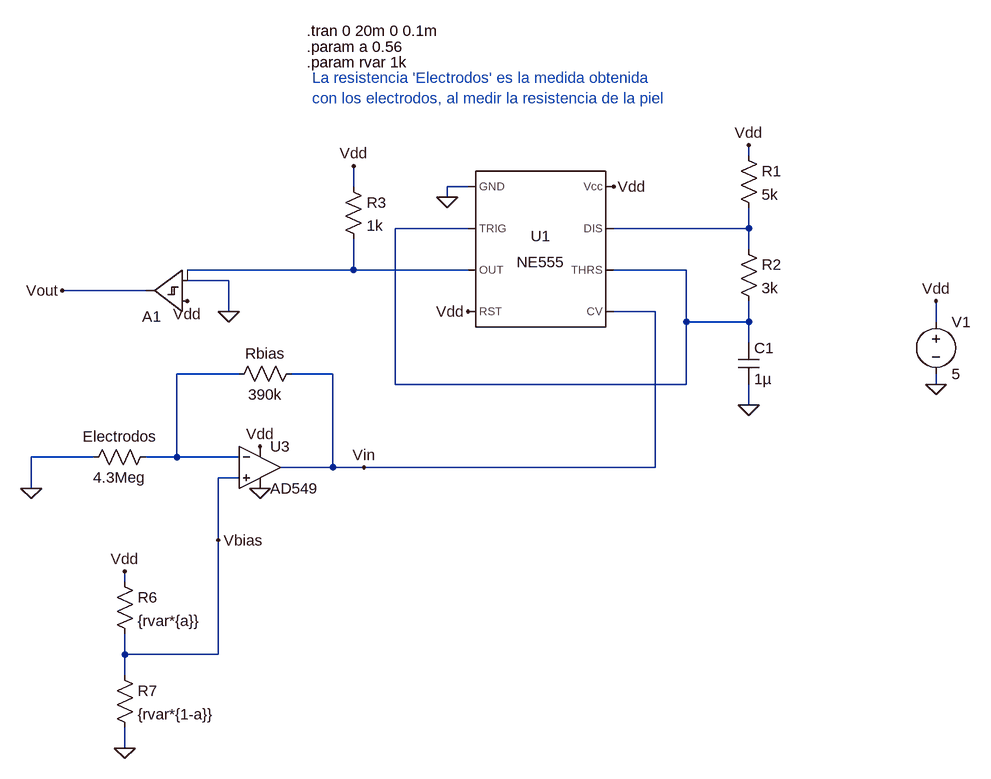
[diagram p0: schematic GSR_esquematico.asc]
GSR_esquematico.asc, the LTspice schematic file:
Version 4
SHEET 1 1032 932
WIRE 528 0 528 -16
WIRE -80 48 -80 16
WIRE 96 48 64 48
WIRE 64 64 64 48
WIRE 96 112 -16 112
WIRE 528 112 528 80
WIRE 528 112 320 112
WIRE 528 144 528 112
WIRE -80 176 -80 128
WIRE -80 176 -336 176
WIRE 96 176 -80 176
WIRE 432 176 320 176
WIRE -272 192 -336 192
WIRE -400 208 -528 208
WIRE -272 240 -272 192
WIRE 384 240 320 240
WIRE 432 256 432 176
WIRE 528 256 528 224
WIRE 528 256 432 256
WIRE 816 256 816 224
WIRE 528 288 528 256
WIRE -256 336 -352 336
WIRE -112 336 -176 336
WIRE -16 352 -16 112
WIRE 432 352 432 256
WIRE 432 352 -16 352
WIRE 816 352 816 336
WIRE 528 384 528 352
WIRE -480 464 -576 464
WIRE -352 464 -352 336
WIRE -352 464 -400 464
WIRE -256 464 -352 464
WIRE -112 480 -112 336
WIRE -112 480 -192 480
WIRE -64 480 -112 480
WIRE 384 480 384 240
WIRE 384 480 -64 480
WIRE -256 496 -288 496
WIRE -576 512 -576 464
WIRE -288 592 -288 496
WIRE -432 656 -432 640
WIRE -432 768 -432 736
WIRE -288 768 -288 592
WIRE -288 768 -432 768
WIRE -432 800 -432 768
WIRE -432 912 -432 880
FLAG 320 48 Vdd
FLAG 96 240 Vdd
FLAG 528 -16 Vdd
FLAG 528 384 0
FLAG 64 64 0
FLAG -80 16 Vdd
FLAG -528 208 Vout
FLAG 816 352 0
FLAG 816 224 Vdd
FLAG -224 512 0
FLAG -576 512 0
FLAG -64 480 Vin
FLAG -224 448 Vdd
FLAG -432 640 Vdd
FLAG -432 912 0
FLAG -272 240 0
FLAG -336 224 Vdd
FLAG -288 592 Vbias
SYMBOL Misc\\NE555 208 144 R0
SYMATTR InstName U1
SYMBOL res 512 -16 R0
SYMATTR InstName R1
SYMATTR Value 5k
SYMBOL res 512 128 R0
SYMATTR InstName R2
SYMATTR Value 3k
SYMBOL cap 512 288 R0
SYMATTR InstName C1
SYMATTR Value 1µ
SYMBOL res -96 32 R0
SYMATTR InstName R3
SYMATTR Value 1k
SYMBOL voltage 816 240 R0
SYMATTR InstName V1
SYMATTR Value 5
SYMBOL res -384 448 R90
WINDOW 0 0 56 VBottom 2
WINDOW 3 32 56 VTop 2
SYMATTR InstName Electrodos
SYMATTR Value 4.3Meg
SYMBOL res -160 320 R90
WINDOW 0 0 56 VBottom 2
WINDOW 3 32 56 VTop 2
SYMATTR InstName Rbias
SYMATTR Value 390k
SYMBOL OpAmps\\AD549 -224 416 R0
SYMATTR InstName U3
SYMBOL res -448 640 R0
SYMATTR InstName R6
SYMATTR Value {rvar*{a}}
SYMBOL res -448 784 R0
SYMATTR InstName R7
SYMATTR Value {rvar*{1-a}}
SYMBOL Digital\\diffschmtbuf -336 272 R180
SYMATTR InstName A1
TEXT -152 -192 Left 2 !.tran 0 20m 0 0.1m
TEXT -152 -168 Left 2 !.param a 0.56
TEXT -152 -144 Left 2 !.param rvar 1k
TEXT -144 -120 Left 2 ;La resistencia 'Electrodos' es la medida obtenida \ncon los electrodos, al medir la resistencia de la piel

The netlist it stands for:
* GSR_esquematico.asc
XU1 0 N001 N003 Vdd Vin N001 N002 Vdd NE555  ; pins GND TRIG OUT RST CV THRS DIS Vcc
R1 Vdd N002 5k
R2 N002 N001 3k
C1 N001 0 1µ
R3 Vdd N003 1k
V1 Vdd 0 5
R§Electrodos N004 0 4.3Meg
Rbias Vin N004 390k
XU3 Vbias N004 Vdd 0 Vin AD549  ; pins In+ In- V+ V- OUT
R6 Vdd Vbias {rvar*{a}}
R7 Vbias 0 {rvar*{1-a}}
A1 Vdd 0 N003 N003 N003 N003 Vout N003 SCHMITT
.tran 0 20m 0 0.1m
.param a 0.56
.param rvar 1k
* La resistencia 'Electrodos' es la medida obtenida
* con los electrodos, al medir la resistencia de la piel
.lib NE555.sub
.backanno
.end